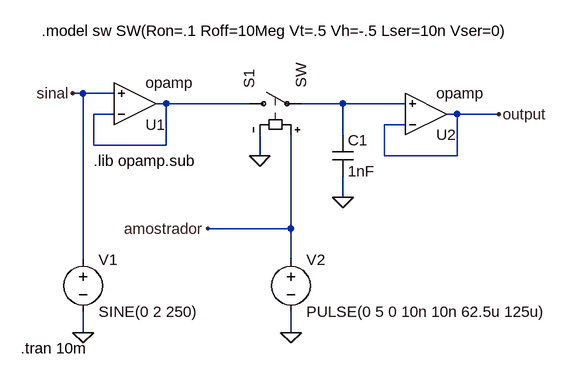
[diagram p0: schematic circuito_sample_and_hold.asc]
circuito_sample_and_hold.asc, the LTspice schematic file:
Version 4
SHEET 1 880 680
WIRE -112 160 -128 160
WIRE -64 160 -112 160
WIRE 16 176 0 176
WIRE 144 176 16 176
WIRE 288 176 224 176
WIRE 384 176 288 176
WIRE -64 192 -96 192
WIRE 464 192 448 192
WIRE 528 192 464 192
WIRE 384 208 352 208
WIRE 288 224 288 176
WIRE -96 240 -96 192
WIRE 16 240 16 176
WIRE 16 240 -96 240
WIRE 160 256 160 224
WIRE 352 256 352 208
WIRE 464 256 464 192
WIRE 464 256 352 256
WIRE 288 320 288 288
WIRE 208 368 208 224
WIRE 208 368 80 368
WIRE -112 416 -112 160
WIRE 208 416 208 368
WIRE -112 528 -112 496
WIRE 208 528 208 496
FLAG 160 256 0
FLAG 288 320 0
FLAG -128 160 sinal
FLAG 528 192 output
FLAG 80 368 amostrador
FLAG -112 528 0
FLAG 208 528 0
SYMBOL Opamps\\opamp -32 240 M180
SYMATTR InstName U1
SYMBOL Opamps\\opamp 416 256 M180
SYMATTR InstName U2
SYMBOL sw 128 176 R270
SYMATTR InstName S1
SYMBOL cap 272 224 R0
SYMATTR InstName C1
SYMATTR Value 1nF
SYMBOL voltage -112 400 R0
WINDOW 123 0 0 Left 2
WINDOW 39 0 0 Left 2
SYMATTR InstName V1
SYMATTR Value SINE(0 2 250)
SYMBOL voltage 208 400 R0
WINDOW 123 0 0 Left 2
WINDOW 39 0 0 Left 2
SYMATTR InstName V2
SYMATTR Value PULSE(0 5 0 10n 10n 62.5u 125u)
TEXT -96 264 Left 2 !.lib opamp.sub
TEXT -176 64 Left 2 !.model sw SW(Ron=.1 Roff=10Meg Vt=.5 Vh=-.5 Lser=10n Vser=0)
TEXT -208 552 Left 2 !.tran 10m

The netlist it stands for:
* circuito_sample_and_hold.asc
XU1 N001 sinal N001 opamp Aol=100K GBW=10Meg  ; pins invin noninvin out
XU2 output N002 output opamp Aol=100K GBW=10Meg  ; pins invin noninvin out
S1 N001 N002 amostrador 0 SW
C1 N002 0 1nF
V1 sinal 0 SINE(0 2 250)
V2 amostrador 0 PULSE(0 5 0 10n 10n 62.5u 125u)
.lib opamp.sub
.model sw SW(Ron=.1 Roff=10Meg Vt=.5 Vh=-.5 Lser=10n Vser=0)
.tran 10m
.backanno
.end